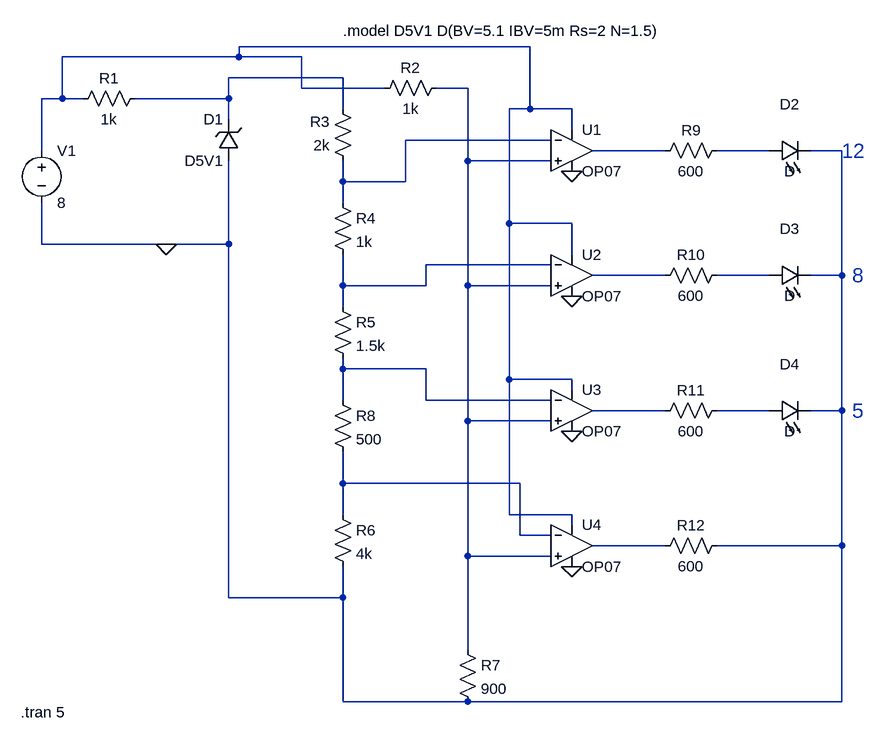
[diagram p0: schematic Portable Battery Checker .asc]
Portable Battery Checker .asc, the LTspice schematic file:
Version 4
SHEET 1 880 752
WIRE 80 -288 -368 -288
WIRE -368 -272 -368 -288
WIRE -368 -272 -640 -272
WIRE -272 -272 -368 -272
WIRE -208 -240 -384 -240
WIRE -272 -224 -272 -272
WIRE -144 -224 -272 -224
WIRE -16 -224 -64 -224
WIRE -640 -208 -640 -272
WIRE -640 -208 -672 -208
WIRE -608 -208 -640 -208
WIRE -384 -208 -384 -240
WIRE -384 -208 -528 -208
WIRE -208 -192 -208 -240
WIRE 80 -192 80 -288
WIRE 80 -192 48 -192
WIRE 144 -192 80 -192
WIRE -384 -176 -384 -208
WIRE 144 -160 144 -192
WIRE 112 -144 -112 -144
WIRE -672 -128 -672 -208
WIRE 288 -128 176 -128
WIRE 448 -128 368 -128
WIRE 560 -128 512 -128
WIRE -16 -112 -16 -224
WIRE 112 -112 -16 -112
WIRE -208 -80 -208 -112
WIRE -112 -80 -112 -144
WIRE -112 -80 -208 -80
WIRE -208 -48 -208 -80
WIRE 48 -16 48 -192
WIRE 144 -16 48 -16
WIRE -672 16 -672 -48
WIRE -480 16 -672 16
WIRE -384 16 -384 -112
WIRE -384 16 -480 16
WIRE 144 32 144 -16
WIRE 112 48 -80 48
WIRE 288 64 176 64
WIRE 448 64 368 64
WIRE 560 64 560 -128
WIRE 560 64 512 64
WIRE -208 80 -208 32
WIRE -80 80 -80 48
WIRE -80 80 -208 80
WIRE -16 80 -16 -112
WIRE 112 80 -16 80
WIRE -208 112 -208 80
WIRE -208 208 -208 192
WIRE -80 208 -208 208
WIRE 48 224 48 -16
WIRE 144 224 48 224
WIRE 144 240 144 224
WIRE -208 256 -208 208
WIRE -80 256 -80 208
WIRE 112 256 -80 256
WIRE 288 272 176 272
WIRE 448 272 368 272
WIRE 560 272 560 64
WIRE 560 272 512 272
WIRE -16 288 -16 80
WIRE 112 288 -16 288
WIRE -208 384 -208 336
WIRE 64 384 -208 384
WIRE -208 432 -208 384
WIRE 48 432 48 224
WIRE 144 432 48 432
WIRE 144 448 144 432
WIRE 64 464 64 384
WIRE 112 464 64 464
WIRE 288 480 176 480
WIRE 560 480 560 272
WIRE 560 480 368 480
WIRE -16 496 -16 288
WIRE 112 496 -16 496
WIRE -384 560 -384 16
WIRE -208 560 -208 512
WIRE -208 560 -384 560
WIRE -16 640 -16 496
WIRE -208 720 -208 560
WIRE -16 720 -208 720
WIRE 560 720 560 480
WIRE 560 720 -16 720
FLAG 144 512 0
FLAG 144 304 0
FLAG 144 96 0
FLAG 144 -96 0
FLAG -480 16 0
SYMBOL voltage -672 -144 R0
WINDOW 123 0 0 Left 0
WINDOW 39 0 0 Left 0
SYMATTR InstName V1
SYMATTR Value 8
SYMBOL res -512 -224 R90
WINDOW 0 0 56 VBottom 2
WINDOW 3 32 56 VTop 2
SYMATTR InstName R1
SYMATTR Value 1k
SYMBOL zener -368 -112 R180
WINDOW 0 24 64 Left 2
WINDOW 3 24 0 Left 2
SYMATTR InstName D1
SYMATTR Value D5V1
SYMBOL res -48 -240 R90
WINDOW 0 0 56 VBottom 2
WINDOW 3 32 56 VTop 2
SYMATTR InstName R2
SYMATTR Value 1k
SYMBOL res -192 -96 R180
WINDOW 0 36 76 Left 2
WINDOW 3 36 40 Left 2
SYMATTR InstName R3
SYMATTR Value 2k
SYMBOL res -224 416 R0
SYMATTR InstName R6
SYMATTR Value 4k
SYMBOL res -32 624 R0
SYMATTR InstName R7
SYMATTR Value 900
SYMBOL OpAmps\\OP07 144 -192 R0
SYMATTR InstName U1
SYMBOL OpAmps\\OP07 144 0 R0
SYMATTR InstName U2
SYMBOL OpAmps\\OP07 144 208 R0
SYMATTR InstName U3
SYMBOL OpAmps\\OP07 144 416 R0
SYMATTR InstName U4
SYMBOL res -224 -64 R0
SYMATTR InstName R4
SYMATTR Value 1k
SYMBOL res -224 96 R0
SYMATTR InstName R5
SYMATTR Value 1.5k
SYMBOL res -224 240 R0
SYMATTR InstName R8
SYMATTR Value 500
SYMBOL res 384 -144 R90
WINDOW 0 0 56 VBottom 2
WINDOW 3 32 56 VTop 2
SYMATTR InstName R9
SYMATTR Value 600
SYMBOL res 384 48 R90
WINDOW 0 0 56 VBottom 2
WINDOW 3 32 56 VTop 2
SYMATTR InstName R10
SYMATTR Value 600
SYMBOL res 384 256 R90
WINDOW 0 0 56 VBottom 2
WINDOW 3 32 56 VTop 2
SYMATTR InstName R11
SYMATTR Value 600
SYMBOL res 384 464 R90
WINDOW 0 0 56 VBottom 2
WINDOW 3 32 56 VTop 2
SYMATTR InstName R12
SYMATTR Value 600
SYMBOL LED 448 -112 R270
WINDOW 0 72 32 VTop 2
WINDOW 3 0 32 VBottom 2
SYMATTR InstName D2
SYMBOL LED 448 80 R270
WINDOW 0 72 32 VTop 2
WINDOW 3 0 32 VBottom 2
SYMATTR InstName D3
SYMBOL LED 448 288 R270
WINDOW 0 72 32 VTop 2
WINDOW 3 0 32 VBottom 2
SYMATTR InstName D4
TEXT -704 736 Left 2 !.tran 5
TEXT -208 -312 Left 2 !.model D5V1 D(BV=5.1 IBV=5m Rs=2 N=1.5)
TEXT 576 64 Left 3 ;8
TEXT 560 -128 Left 3 ;12
TEXT 576 272 Left 3 ;5

The netlist it stands for:
* Portable Battery Checker .asc
V1 N001 0 8
R1 N002 N001 1k
D1 0 N002 D5V1
R2 N003 N001 1k
R3 N004 N002 2k
R6 N013 0 4k
R7 N003 0 900
XU1 N003 N004 N001 0 N005 LT1001  ; OP07, pins In+ In- V+ V- OUT
XU2 N003 N007 N001 0 N008 LT1001  ; OP07, pins In+ In- V+ V- OUT
XU3 N003 N010 N001 0 N011 LT1001  ; OP07, pins In+ In- V+ V- OUT
XU4 N003 N013 N001 0 N014 LT1001  ; OP07, pins In+ In- V+ V- OUT
R4 N004 N007 1k
R5 N007 N010 1.5k
R8 N010 N013 500
R9 N006 N005 600
R10 N009 N008 600
R11 N012 N011 600
R12 0 N014 600
D2 N006 0 D
D3 N009 0 D
D4 N012 0 D
.model D D
.lib standard.dio
.tran 5
.model D5V1 D(BV=5.1 IBV=5m Rs=2 N=1.5)
* 8
* 12
* 5
.lib LTC.lib
.backanno
.end